# Altium schematic sheet Top.SchDoc: STM32 LoRa Node
size A4; Author: Leon Baždar; CompanyName: FER; Address1: Zagreb; Revision: V1.0; SheetNumber: 1; SheetTotal: 6
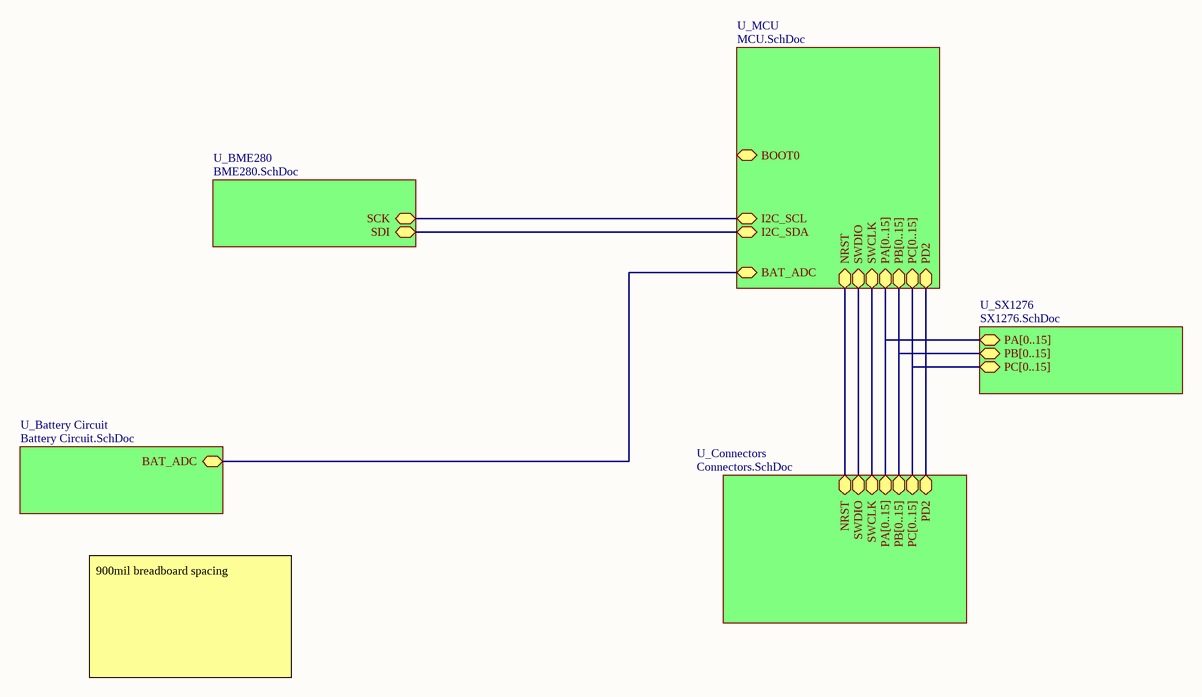
[diagram p0: Top.SchDoc]

## Sub-sheets
U_Battery Circuit = Battery Circuit.SchDoc: BAT_ADC (bidir)
U_BME280 = BME280.SchDoc: SCK (bidir), SDI (bidir)
U_Connectors = Connectors.SchDoc: NRST (bidir), SWDIO (bidir), SWCLK (bidir), PB[0..15] (bidir), PA[0..15] (bidir), PC[0..15] (bidir), PD2 (bidir)
U_MCU = MCU.SchDoc: NRST (bidir), PB[0..15] (bidir), PC[0..15] (bidir), PA[0..15] (bidir), BOOT0 (bidir), SWDIO (bidir), I2C_SCL (bidir), I2C_SDA (bidir), SWCLK (bidir), PD2 (bidir), BAT_ADC (bidir)
U_SX1276 = SX1276.SchDoc: PA[0..15] (bidir), PB[0..15] (bidir), PC[0..15] (bidir)

## Nets
(unnamed): sheet U_Battery Circuit/BAT_ADC, sheet U_MCU/BAT_ADC
(unnamed): sheet U_MCU/NRST, sheet U_Connectors/NRST
(unnamed): sheet U_MCU/SWDIO, sheet U_Connectors/SWDIO
(unnamed): sheet U_MCU/I2C_SCL, sheet U_BME280/SCK
(unnamed): sheet U_MCU/I2C_SDA, sheet U_BME280/SDI
(unnamed): sheet U_MCU/SWCLK, sheet U_Connectors/SWCLK
(unnamed): sheet U_MCU/PD2, sheet U_Connectors/PD2

## Buses and harness runs
bus sheet U_Connectors/PA[0..15] = sheet U_MCU/PA[0..15] = sheet U_SX1276/PA[0..15]
bus sheet U_Connectors/PB[0..15] = sheet U_MCU/PB[0..15] = sheet U_SX1276/PB[0..15]
bus sheet U_Connectors/PC[0..15] = sheet U_MCU/PC[0..15] = sheet U_SX1276/PC[0..15]

## Notes on the sheet
- 900mil breadboard spacing
- Project:
- File:
- Size:
- A4
- Author:
- Revision:
- Date:
- Sheet
- of